# EAGLE design Esquematico (EAGLE 7.4.0)
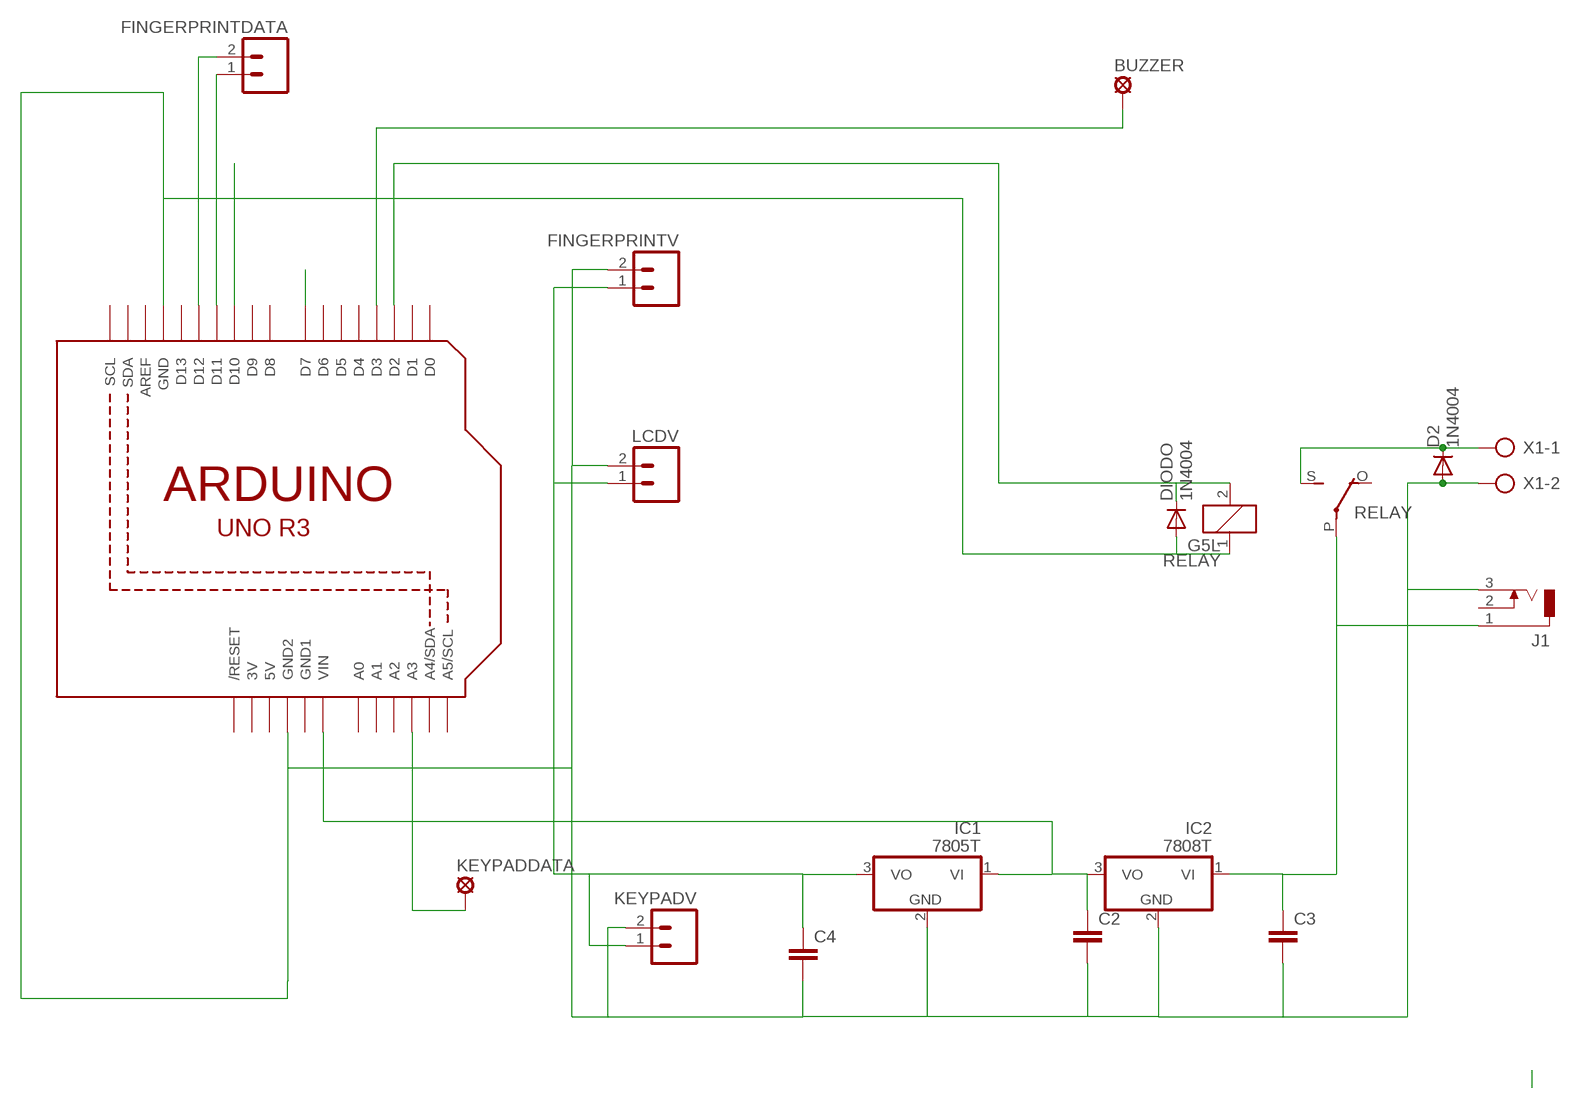
[diagram p0: schematic, sheet 1]

## Parts
BUZZER  SE14  [SE14]
C2  C-EU025-030X050  [C025-030X050]
C3  C-EU025-030X050  [C025-030X050]
C4  C-EU025-030X050  [C025-030X050]
D2  1N4004  [DO41-10]
DIODO  1N4004  [DO41-10]
FINGERPRINTDATA  M02  [02P]
FINGERPRINTV  M02  [02P]
IC1  7805T  [TO220H]
IC2  7808T  [TO220H]
J1  DCJ0303  [DCJ0303]
KEYPADDATA  SE14  [SE14]
KEYPADV  M02  [02P]
LCDV  M02  [02P]
Q1  ARDUINOR3-NOIOREF-NOTEXT  [ARDUINOR3-NOTEXT-NOIOREF]
RELAY  G5L  [G5LE]
X1  AK300/2  [AK300/2]

## Nets
N$1: Q1.D7
N$3: FINGERPRINTDATA.2 Q1.D12
N$4: FINGERPRINTDATA.1 Q1.D11
N$7: D2.C RELAY.S(2:S) X1.1
N$8: KEYPADDATA.MP Q1.A3
N$11: BUZZER.MP Q1.D3
N$12: C4.1 FINGERPRINTV.1 IC1.3(VO) KEYPADV.1 LCDV.1
N$13: DIODO.C Q1.D2 RELAY.2
N$14: DIODO.A Q1.GND RELAY.1
N$15: C2.2 C3.2 C4.2 D2.A FINGERPRINTV.2 IC1.2(GND) IC2.2(GND) J1.3 KEYPADV.2 LCDV.2 Q1.GND2 X1.2
N$18: Q1.D10
N$19: C2.1 IC1.1(VI) IC2.3(VO) Q1.VIN
N$22: C3.1 IC2.1(VI) J1.1 RELAY.P(2:P)
Unconnected: J1.2 Q1.A0 Q1.A1 Q1.A2 Q1.A4(A4/SDA) Q1.A5(A5/SCL) Q1.AREF Q1.D0 Q1.D1 Q1.D4 Q1.D5 Q1.D6 Q1.D8 Q1.D9 Q1.D13 Q1.RESET(/RESET) Q1.SCL Q1.SDA RELAY.O(2:O)

## Power pins joined to a net without a drawn wire
3V: Q1.3V
5V: Q1.5V
GND1: Q1.GND1

## Library data of the parts
BUZZER KEYPADDATA = solpad:SE14: SOLDER PAD E1553, drill 1,4mm, distributor Buerklin, 07F820
C2-C4 = resistor:C-EU: CAPACITOR, European symbol
D2 = diode:1N4004: DIODE
DIODO = adafruit:1N4004: DIODE
FINGERPRINTDATA FINGERPRINTV KEYPADV LCDV = con-amp-quick:M02: AMP QUICK CONNECTOR; OC_FARNELL: unknown; OC_NEWARK: unknown
IC1 IC2 = linear:78*: Positive VOLTAGE REGULATOR Source: http://cache.national.com/ds/LM/LM78L05.pdf http://www.fairchildsemi.com/ds/LM/LM7805.pdf
J1 = con-jack:DCJ0303: DC POWER JACK Source: DCJ0303.pdf; OC_FARNELL: unknown; OC_NEWARK: unknown
Q1 = adafruit:ARDUINOR3-NOIOREF
RELAY = relay:G5L: RELAY 1 x switch, 10 A/120 V AC, 8 A/30 V ADC, Omron; OC_FARNELL: unknown; OC_NEWARK: unknown
X1 = con-ptr500:AK300/2: CONNECTOR; OC_FARNELL: unknown; OC_NEWARK: unknown

## Board
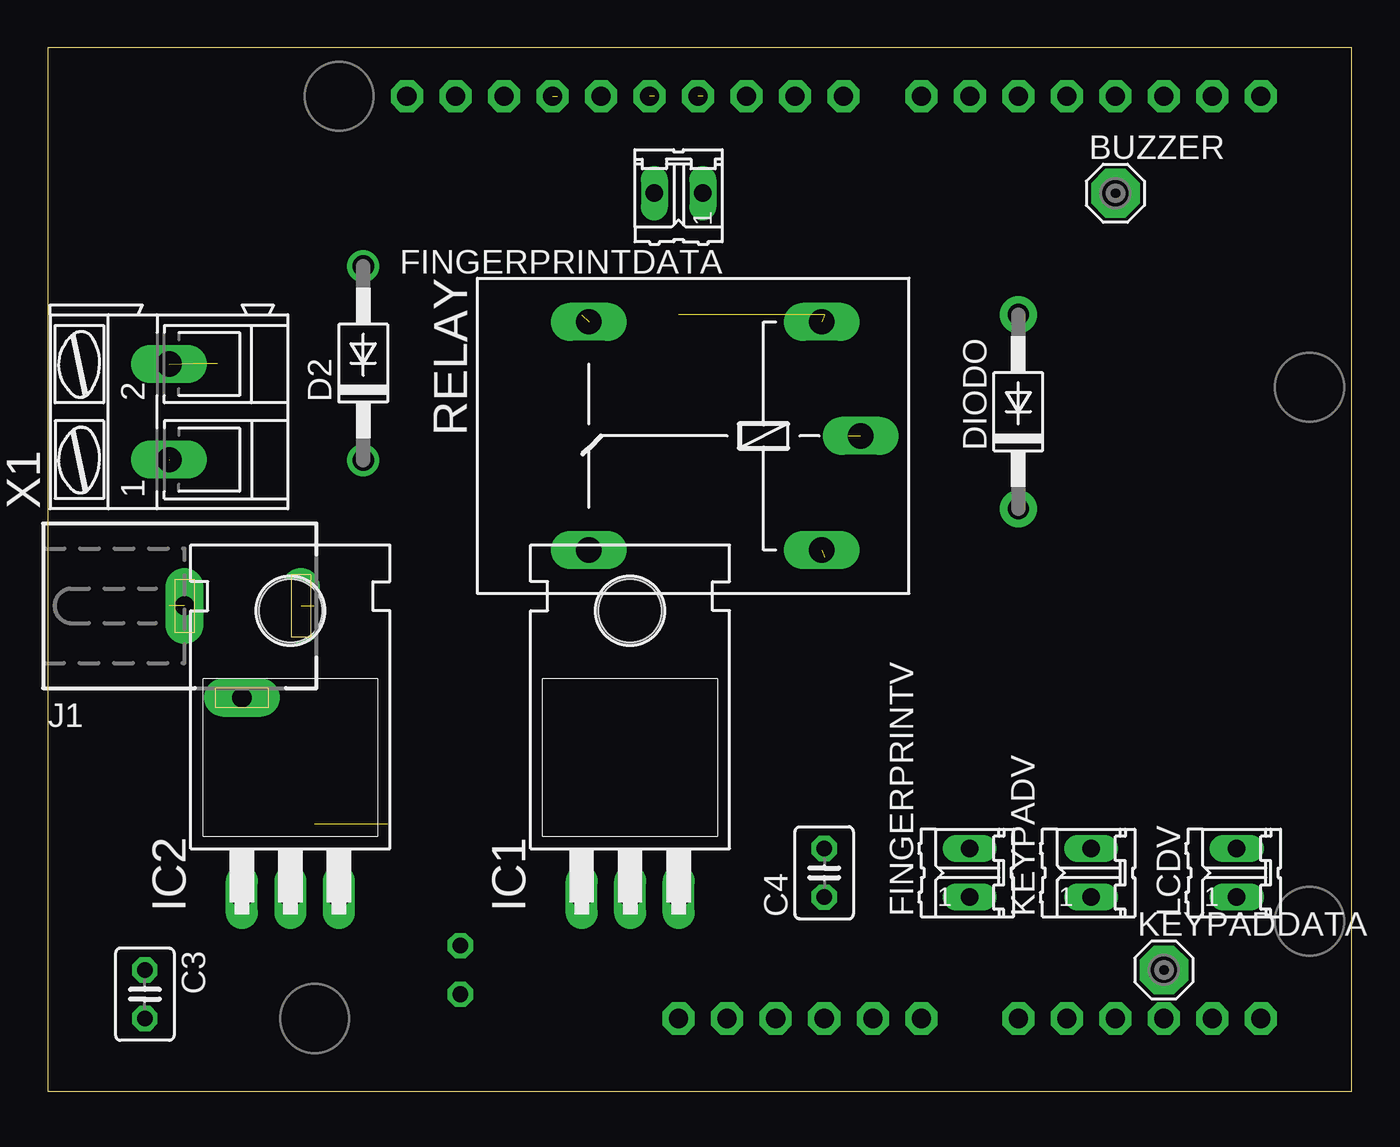
[diagram p1: board, top side]
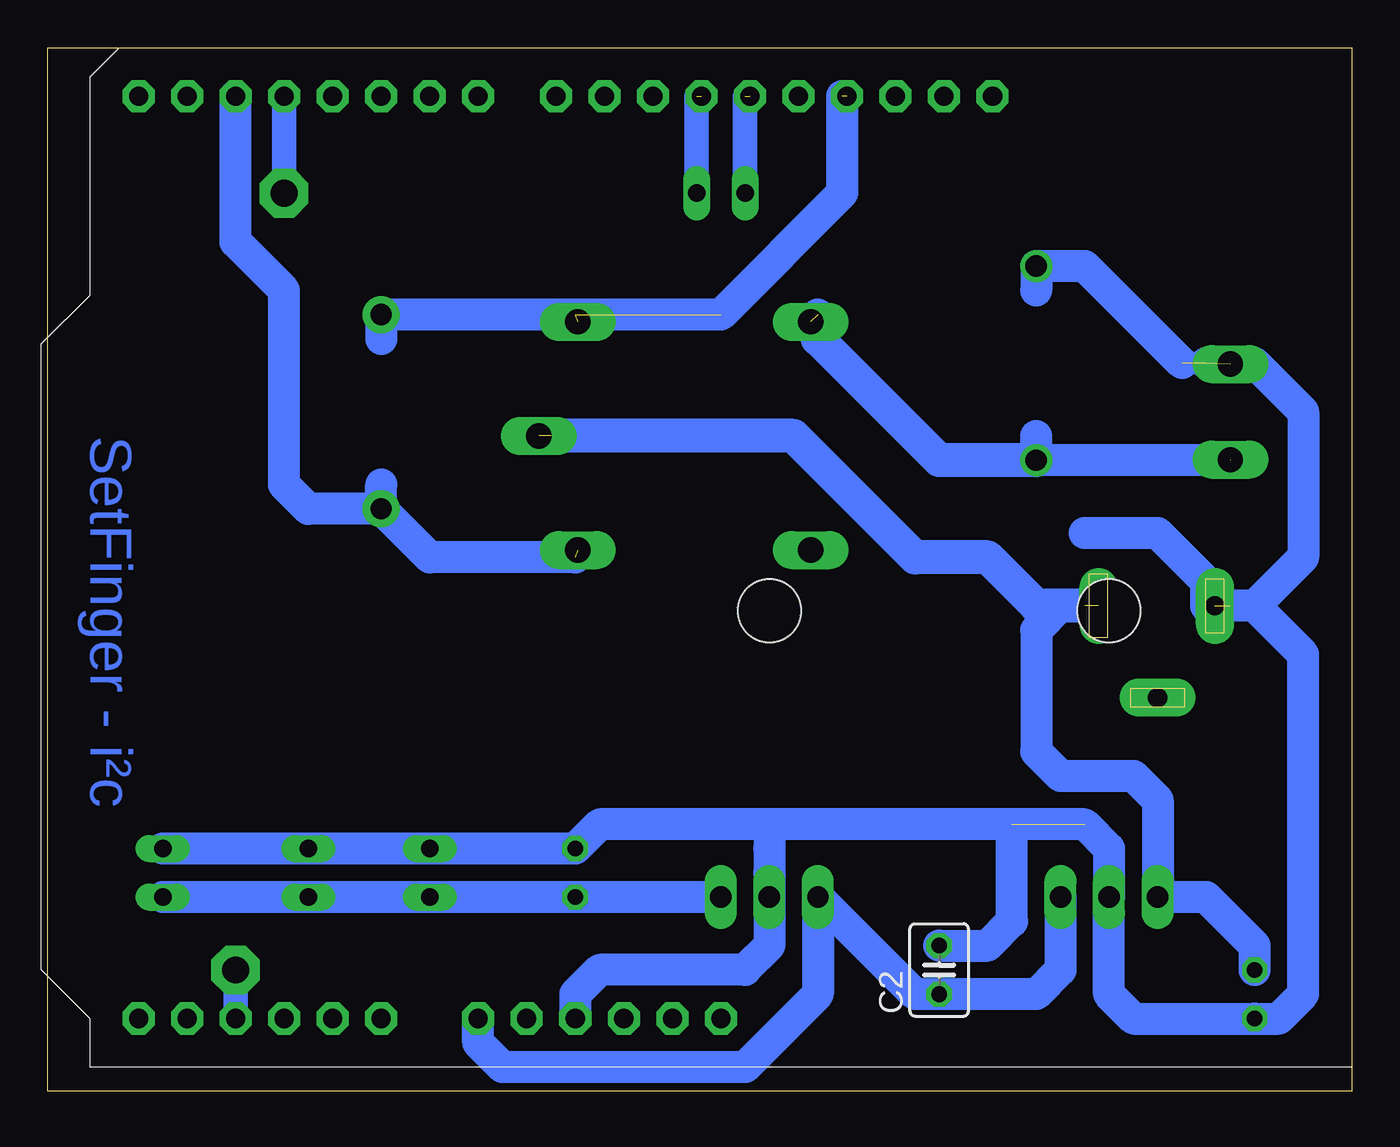
[diagram p2: board, bottom side, seen from below]

Size 68.25 x 54.6 mm. Coordinates in mm from the lower left corner, seen from the top.
Outline: 0,0 68.25,0 68.25,54.6 0,54.6 0,0
Copper layers (1*16): Top 0.035mm / dielectric 1.5mm / Bottom 0.035mm
Design rules "default": minimum track width 10mil, minimum drill 24mil, track to track 8mil, track to pad 8mil, pad to pad 8mil, via to via 8mil, smd to smd 8mil, copper to edge 40mil, drill to drill 8mil, minimum pad ring 10mil, minimum via ring 8mil, stop-mask expansion 4mil, vias tented up to drill 0mil, thermal gap 10mil

### Footprints (pad centres in the part's own frame; a part is rotated, then mirrored left to right if it is on the bottom)
SE14 = drill 1.397 pad 2.54 octagon: MP 0,0
C025-030X050 = drill 0.813 octagon: 1 -1.27,0; 2 1.27,0
DO41-10 = drill 1.118: A 5.08,0; C -5.08,0
DO41-10' = drill 1.118 pad 1.93: A 5.08,0; C -5.08,0
02P = drill 0.914 long: 1 -1.27,0; 2 1.27,0
TO220H = drill 1.118 long: 1 -2.54,-10.16; 2 0,-10.16; 3 2.54,-10.16 | hole 3.302: 0,4.826
DCJ0303 = drill 1 pad 2 long: 1 0,3.1; 2 4.8,0; 3 0,-3
ARDUINOR3-NOTEXT-NOIOREF = drill 1 pad 1.676 octagon: 3V 35.56,2.54; 5V 38.1,2.54; A0 50.8,2.54; A1 53.34,2.54; A2 55.88,2.54; A3 58.42,2.54; A4 60.96,2.54; A5 63.5,2.54; AREF 23.876,50.8; D0 63.5,50.8; D1 60.96,50.8; D2 58.42,50.8; D3 55.88,50.8; D4 53.34,50.8; D5 50.8,50.8; D6 48.26,50.8; D7 45.72,50.8; D8 41.656,50.8; D9 39.116,50.8; D10 36.576,50.8; D11 34.036,50.8; D12 31.496,50.8; D13 28.956,50.8; GND 26.416,50.8; GND1 43.18,2.54; GND2 40.64,2.54; RESET 33.02,2.54; SCL 18.796,50.8; SDA 21.336,50.8; VIN 45.72,2.54
G5LE = drill 1.321 long: 1 -7.493,-5.969; 2 -7.493,5.969; O 4.699,5.969; P -9.525,0; S 4.699,-5.969
AK300/2 = drill 1.321 long: 1 -2.515,0; 2 2.489,0

### Placement (x,y rotation side)
BUZZER  55.88,46.99 0 top
C2  21.59,6.35 90 bottom
C3  5.08,5.08 270 top
C4  40.64,11.43 90 top
D2  16.51,38.1 90 top
DIODO  1N4004  [DO41-10']  50.8,35.56 90 top
FINGERPRINTDATA  33.02,46.99 180 top
FINGERPRINTV  48.26,11.43 90 top
IC1  30.48,20.32 0 top
IC2  12.7,20.32 0 top
J1  10.16,25.4 270 top
KEYPADDATA  58.42,6.35 0 top
KEYPADV  54.61,11.43 90 top
LCDV  62.23,11.43 90 top
Q1  0,1.27 0 top
RELAY  33.02,34.29 180 top
X1  6.35,35.56 90 top

### Tracks (layer width: path | path; a pad name or v marks a point on that pad's centre or on a via)
N$3  (1 unrouted)
  Bottom 1.27: FINGERPRINTDATA.2 31.75,52.07
N$4  (1 unrouted)
  Bottom 1.27: 34.29,52.07 FINGERPRINTDATA.1
N$7  (2 unrouted)
  Bottom 1.676: 6.35,33.02 D2.C 16.51,34.29 | 27.94,39.37 27.94,40.64
  Bottom 1.778: D2.C 21.59,33.02 27.94,39.37
N$8
  Bottom 1.27: KEYPADDATA.MP Q1.A3
N$11
  Bottom 1.27: Q1.D3 BUZZER.MP
N$12
  Bottom 1.676: IC1.3 C4.1 FINGERPRINTV.1 KEYPADV.1 LCDV.1
N$13  (1 unrouted)
  Bottom 1.676: 40.64,27.94 48.26,27.94 DIODO.C | DIODO.C 54.61,30.48 55.88,31.75 55.88,41.91 58.42,44.45 Q1.D2 | DIODO.C 50.8,31.75
N$14  (3 unrouted)
  Bottom 1.676: 26.67,52.07 26.67,46.99 33.02,40.64 DIODO.A 50.8,39.37
N$15  (4 unrouted)
  Bottom 1.676: 7.62,38.1 5.08,38.1 2.54,35.56 2.54,27.94 5.08,25.4 | 30.48,11.43 IC1.2 | IC1.2 30.48,7.62 31.75,6.35 39.37,6.35 40.64,5.08 Q1.GND2 | 30.48,12.7 IC1.2 | 30.48,13.97 IC1.2 | LCDV.2 KEYPADV.2 FINGERPRINTV.2 C4.2 39.37,13.97 30.48,13.97 | 5.08,25.4 2.54,22.86 2.54,5.08 3.81,3.81 C3.2 11.43,3.81 12.7,5.08 IC2.2 12.7,12.7 13.97,13.97 30.48,13.97 | 8.89,38.1 13.97,43.18 D2.A 16.51,41.91 | C2.2 19.05,7.62 17.78,8.89 17.78,13.97 | 5.08,25.4 6.35,25.4
N$19
  Bottom 1.676: IC2.3 15.24,6.35 16.51,5.08 C2.1 22.86,5.08 IC1.1 27.94,5.08 31.75,1.27 44.45,1.27 45.72,2.54 Q1.VIN
N$22  (2 unrouted)
  Bottom 1.676: 13.97,25.4 15.24,25.4 16.51,24.13 16.51,17.78 15.24,16.51 11.43,16.51 10.16,15.24 IC2.1 7.62,10.16 5.08,7.62 C3.1
  Bottom 1.778: 13.97,25.4 16.51,25.4 19.05,27.94 22.86,27.94 29.21,34.29 41.91,34.29
N$24
  Bottom 1.676: 7.62,25.4 7.62,26.67 10.16,29.21 13.97,29.21

### Text on the board
Bottom: SetFinger - i²c